# EasyEDA Pro project 科协作业.eprj

# Schematic Schematic1
Board Name: Board1; Create Date: 2024-11-24; Page Name: P1; Project Name: 科协作业; Schematic Name: Schematic1; Update Date: 2024-11-25; Company: 嘉立创EDA; Page Size: A4; Version: V1.0
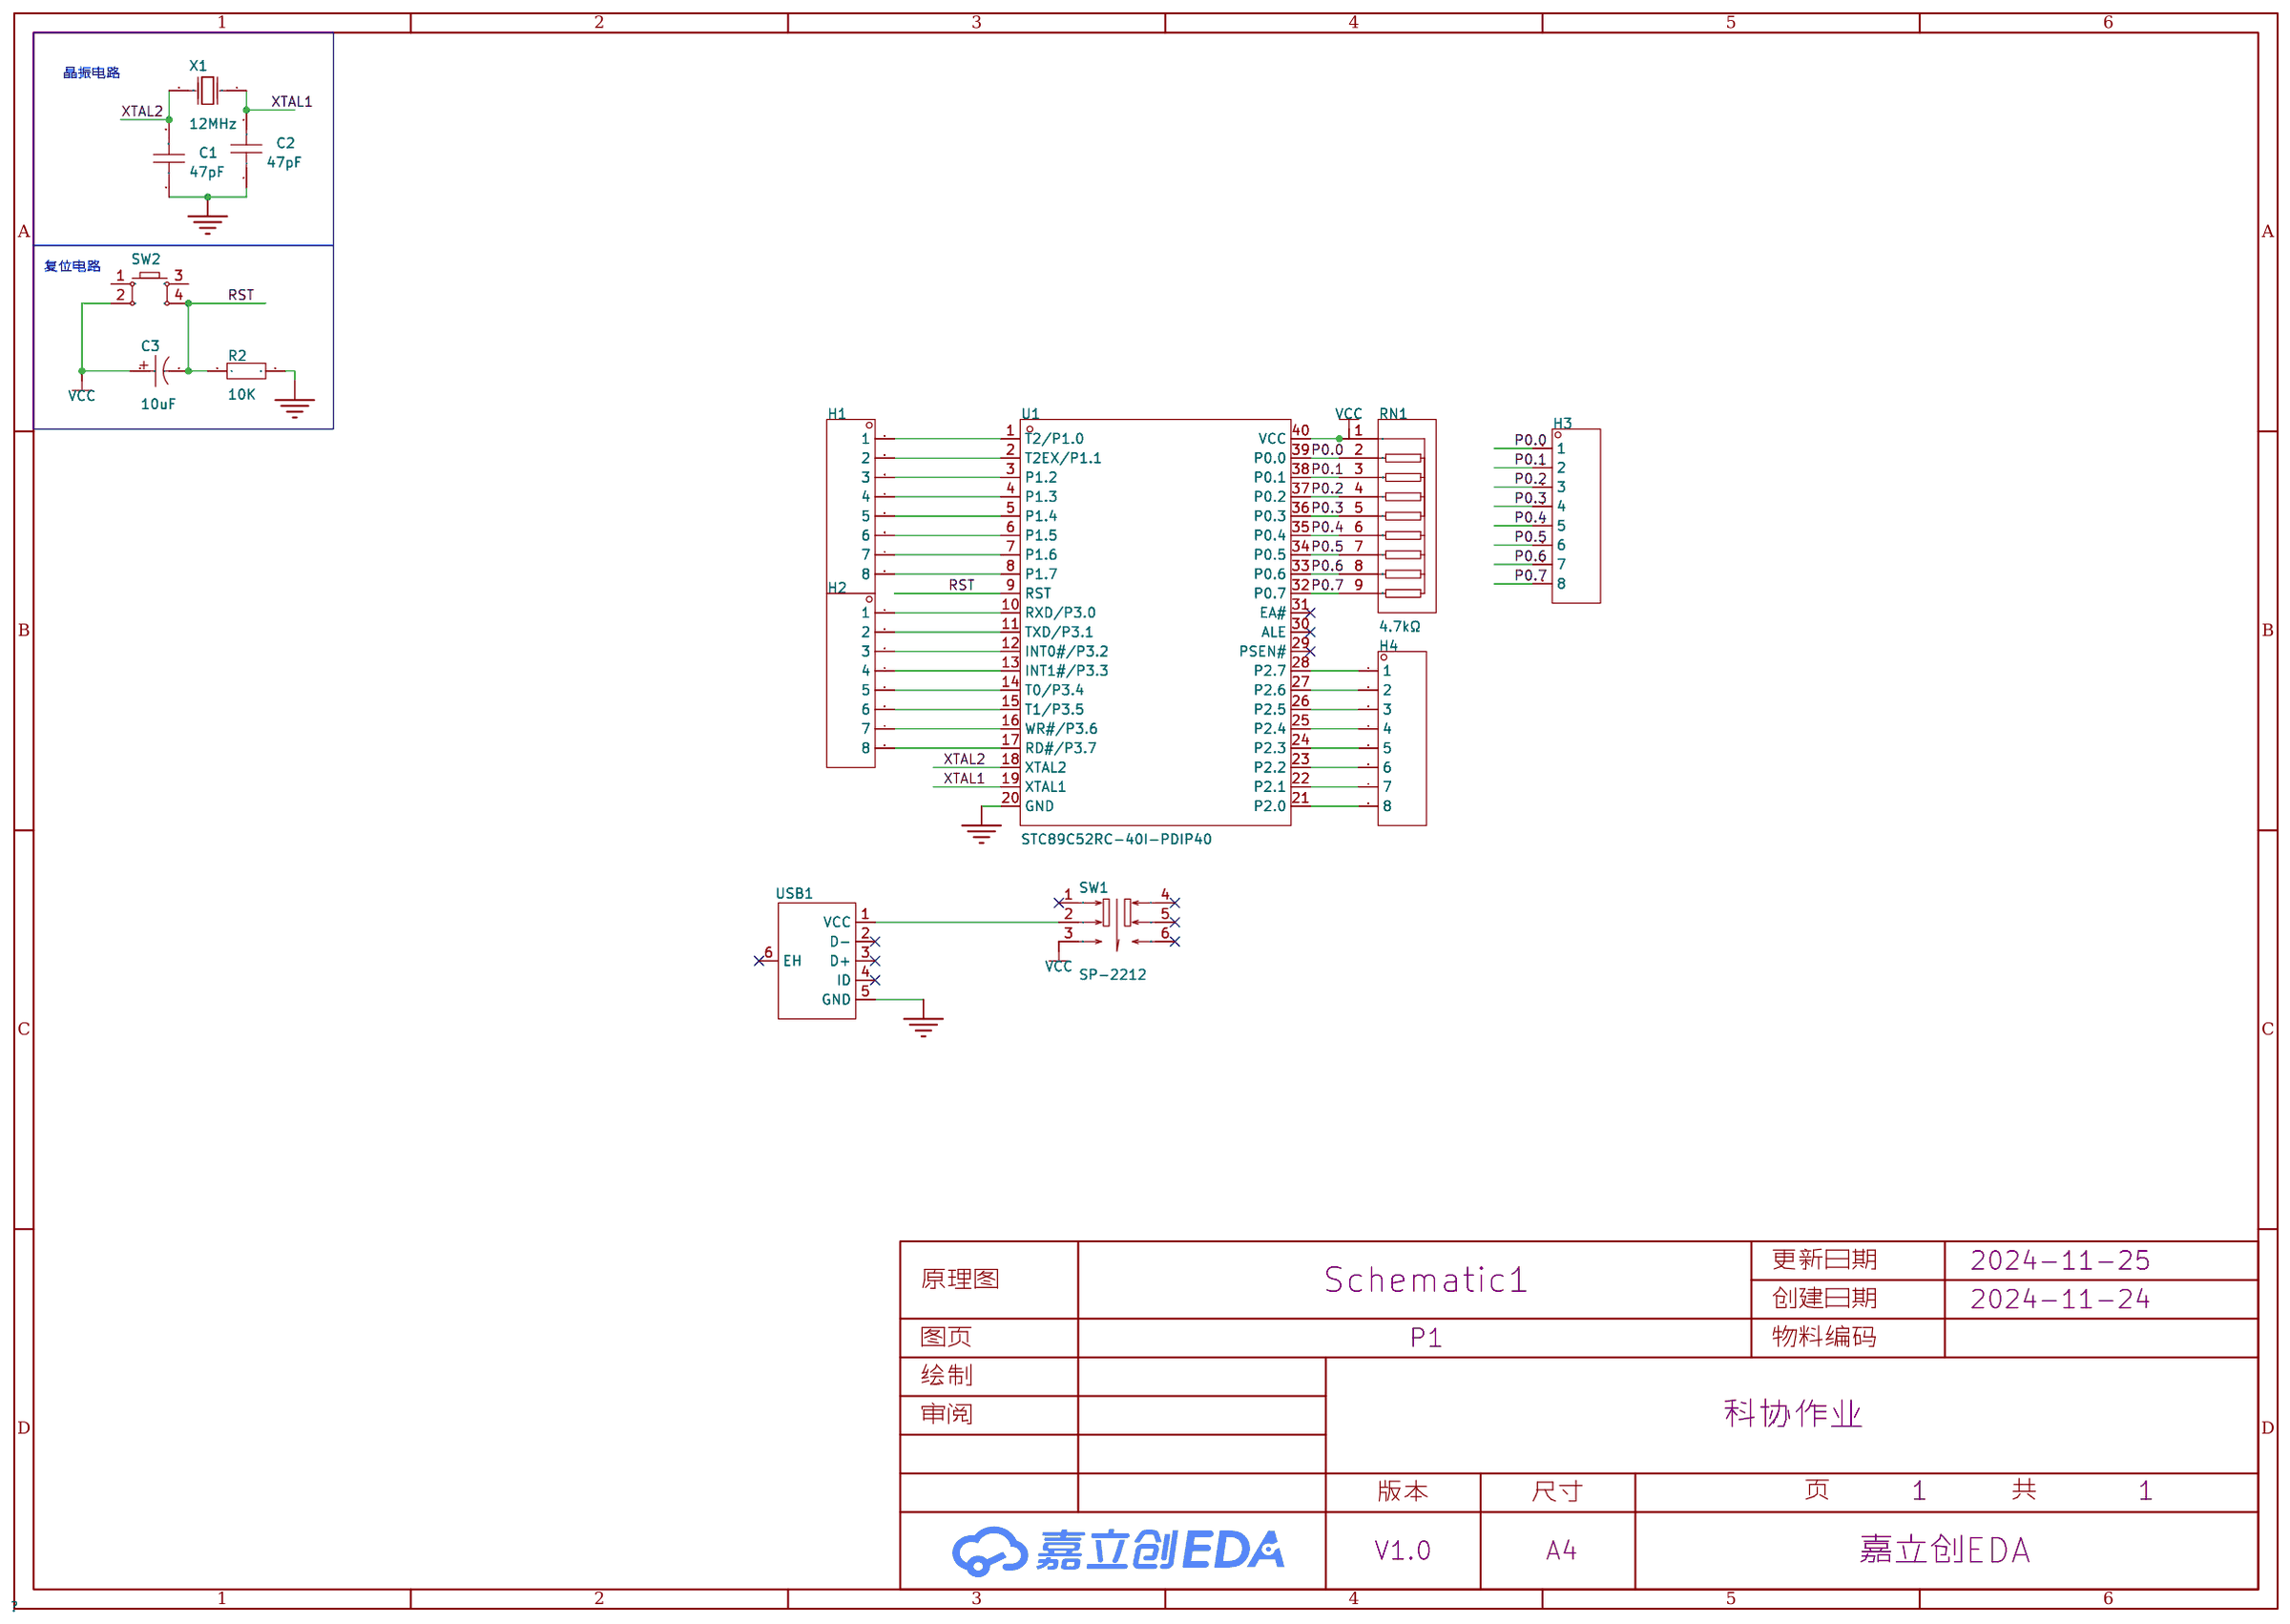
[diagram p0: schematic sheet]

## Parts
C1  47pF  [C0603]
C2  47pF  [C0603]
C3  10uF  [CAP-TH_BD10.0-P5.00-D1.0-FD]
H1  -  [HDR-TH_8P-P2.54-V-M]
H2  -  [HDR-TH_8P-P2.54-V-M]
H3  -  [HDR-TH_8P-P2.54-V-M]
H4  -  [HDR-TH_8P-P2.54-V-M]
R2  10K  [R2010]
RN1  4.7kΩ  [RES-ARRAY-TH_9P-P2.54-D1.0]
SW1  SP-2212  [SW-TH_6P-L7.2-W7.2-P2.00-LS5.0]
SW2  -  [Key_SMD_12x12x7.3]
U1  STC89C52RC-40I-PDIP40  [DIP-40_L52.0-W13.7-P2.54-LS15.2-BL]
USB1  -  [USB_Micro]
X1  12MHz  [HC-49US_L11.5-W4.5-P4.88]

## Library data of the parts
C1 C2 = CAP_0603: Supplier Footprint: 0603
C3 = ERS1HM221G16OT: LCSC Part Name: 220uF ±20% 50V; Supplier Part: C106660; Manufacturer: AISHI(艾华集团); Supplier Footprint: 插件,D10xL16mm; Datasheet: https://atta.szlcsc.com/upload/public/pdf/source/20191015/C438940_4B8E60A742BB0AE40DDEF87A5C89089D.pdf; Supplier: LCSC; Tolerance: ±20%; Rated Voltage: 50V; Lead Spacing: 5mm; φD: 10mm; L: 16mm; Lifetime @ Temp: 7000hrs@105℃
H1-H4 = HDR-M_2.54_1x8P: Supplier Part: C124381; Supplier Footprint: 插件
R2 = Res_2010: Supplier Footprint: 2010
RN1 = A09-472JP: LCSC Part Name: 4.7kΩ ±5%; Supplier Part: C9112; Manufacturer: FH(风华); Supplier Footprint: SIP-9-2.54mm; JLCPCB Part Class: 扩展库; Datasheet: https://atta.szlcsc.com/upload/public/pdf/source/20181127/C336620_2E84FA9E7B5BF76546BC661699514FB8.pdf; Supplier: LCSC; Number of Resistors: 8; Tolerance: ±5%; Power(Watts): 125mW; Temperature Coefficient: ±100ppm/℃; Number of Pins: 9
SW1 = SP-2212: LCSC Part Name: 轻触开关自锁; Supplier Part: C589287; Manufacturer: RISHENG(日昇); Supplier Footprint: 插件; JLCPCB Part Class: 扩展库; Datasheet: https://atta.szlcsc.com/upload/public/pdf/source/20200922/C589287_2DDFEABD4C802D7BFB6520C1CABFFDEF.pdf; Supplier: LCSC; Circuit: 双刀双掷; Self Lock / No Lock: 自锁; Actuator Style: 矩形柱塞; Mounting Style: 直插; Contact Current: 100mA; Voltage Rating (DC): 30V; Insulation Resistance: 100MΩ; Actuator/Cap Color: 蓝色; Pin Style: PC引脚; Operating Force: 230gf; Mechanical Life: 1.2万次
SW2 = Key_SMD_12x12x7.3: Supplier Footprint: SMD
U1 = STC89C52RC-40I-PDIP40: Supplier Part: C14022; Manufacturer: STC(宏晶); Supplier Footprint: DIP-40; JLCPCB Part Class: 扩展库; Datasheet: https://atta.szlcsc.com/upload/public/pdf/source/20210104/C14022_3E6032FDBB5DBC6F971AD019A8472F5B.pdf; Supplier: LCSC; CPU Core: 51系列; Program Storage Size: 8KB; RAM Size: 512Byte; GPIO Ports Number: 35; Operating Voltage Range: 3.3V~5.5V; Program Memory Type: FLASH; Operating Temperature Range: -40℃~+85℃; 16Bit Timer: 3; UART/USART: 1; Peripheral/Function: 看门狗; Watchdog: 有
USB1 = USB_Micro-B: Supplier Footprint: SMD
X1 = X49SD13MSD2SC: LCSC Part Name: 13MHz ±20ppm 20pF; Supplier Part: C30216; Manufacturer: YXC(扬兴晶振); Supplier Footprint: HC-49S; JLCPCB Part Class: 扩展库; Datasheet: https://atta.szlcsc.com/upload/public/pdf/source/20240329/977D7F2434F98B2BE33270BB9FF3D86D.pdf; Supplier: LCSC; Crystal Type: 直插晶振; Normal temperature Frequency Tolerance: ±20ppm; External load capacitor: 20pF; Frequency Stability(Full temperature range): ±30ppm; Operating Temperature: -20℃~+70℃

## Nets
GND: C1.1 C2.1 R2.2 U1.20(GND) USB1.5(GND)
VCC: C3.1 RN1.1 SW1.3 SW2.2 U1.40(VCC)
P0.0: H3.1 RN1.2 U1.39(P0.0)
P0.1: H3.2 RN1.3 U1.38(P0.1)
P0.2: H3.3 RN1.4 U1.37(P0.2)
P0.3: H3.4 RN1.5 U1.36(P0.3)
P0.4: H3.5 RN1.6 U1.35(P0.4)
P0.5: H3.6 RN1.7 U1.34(P0.5)
P0.6: H3.7 RN1.8 U1.33(P0.6)
P0.7: H3.8 RN1.9 U1.32(P0.7)
RST: C3.2 R2.1 SW2.4 U1.9(RST)
XTAL1: C2.2 U1.19(XTAL1) X1.1(OSC1)
XTAL2: C1.2 U1.18(XTAL2) X1.2(OSC2)
$1N1017: H1.1 U1.1(T2/P1.0)
$1N1021: H1.2 U1.2(T2EX/P1.1)
$1N1026: H1.3 U1.3(P1.2)
$1N1031: H1.4 U1.4(P1.3)
$1N1036: H1.5 U1.5(P1.4)
$1N1041: H1.6 U1.6(P1.5)
$1N1046: H1.7 U1.7(P1.6)
$1N1051: H1.8 U1.8(P1.7)
$1N1056: H2.1 U1.10(RXD/P3.0)
$1N1061: H2.2 U1.11(TXD/P3.1)
$1N1066: H2.3 U1.12(INT0#/P3.2)
$1N1074: H2.4 U1.13(INT1#/P3.3)
$1N1079: H2.5 U1.14(T0/P3.4)
$1N1084: H2.6 U1.15(T1/P3.5)
$1N1089: H2.7 U1.16(WR#/P3.6)
$1N1094: H2.8 U1.17(RD#/P3.7)
$1N1233: H4.1 U1.28(P2.7)
$1N1238: H4.2 U1.27(P2.6)
$1N1243: H4.3 U1.26(P2.5)
$1N1251: H4.4 U1.25(P2.4)
$1N1259: H4.5 U1.24(P2.3)
$1N1264: H4.6 U1.23(P2.2)
$1N1272: H4.7 U1.22(P2.1)
$1N1277: H4.8 U1.21(P2.0)
$1N1282: SW1.2 USB1.1(VCC)

Not connected (* = marked no-connect by the designer): SW1 1* 4* 5* 6*; SW2 1 3; U1 29(PSEN#)* 30(ALE)* 31(EA#)*; USB1 2(D-)* 3(D+)* 4(ID)* 6(EH)*

## Notes on the sheet
- 晶振电路
- 复位电路

# Board PCB1
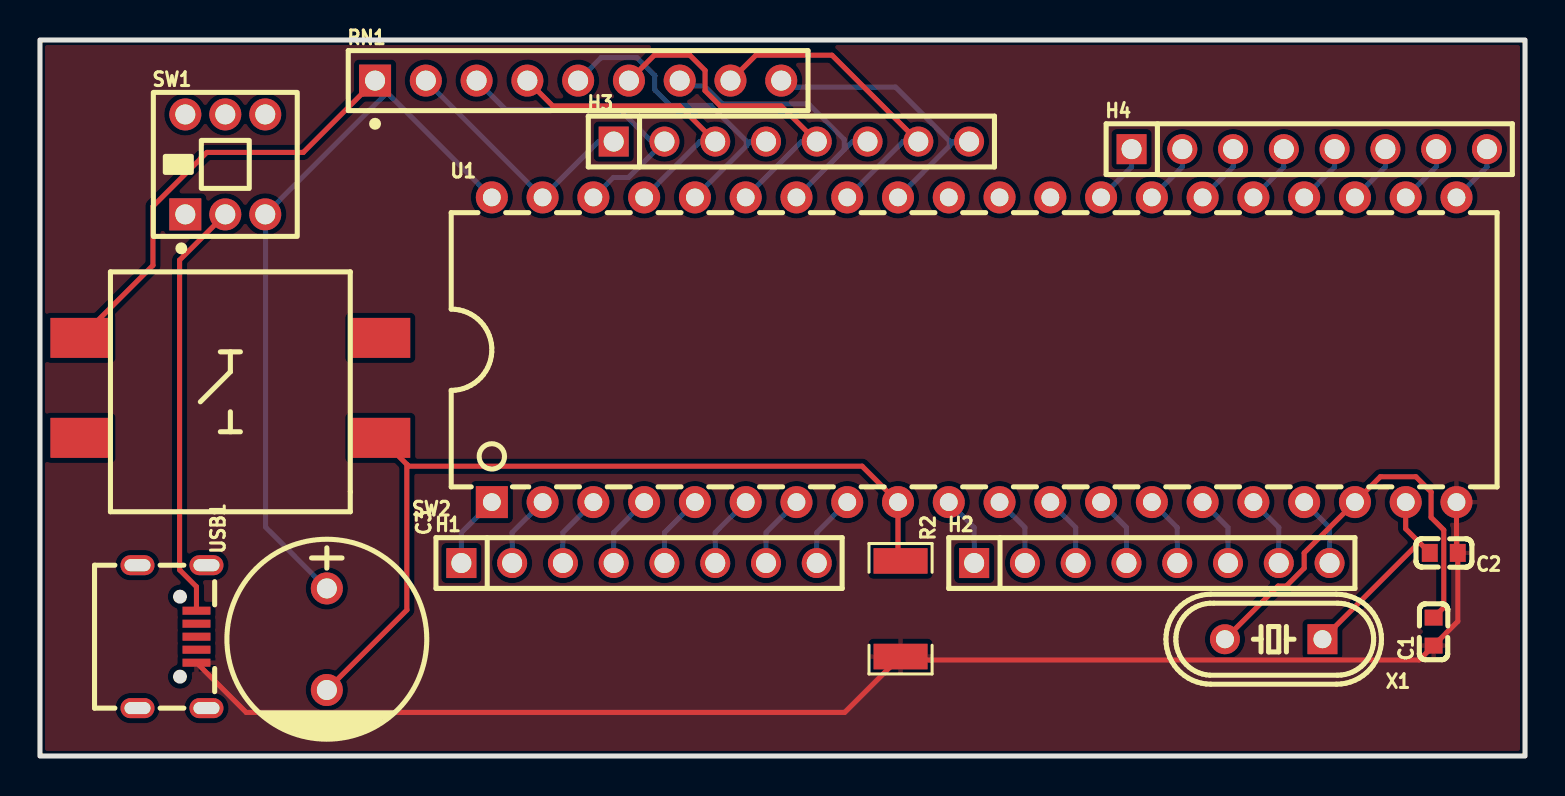
[diagram p1: board, top side]
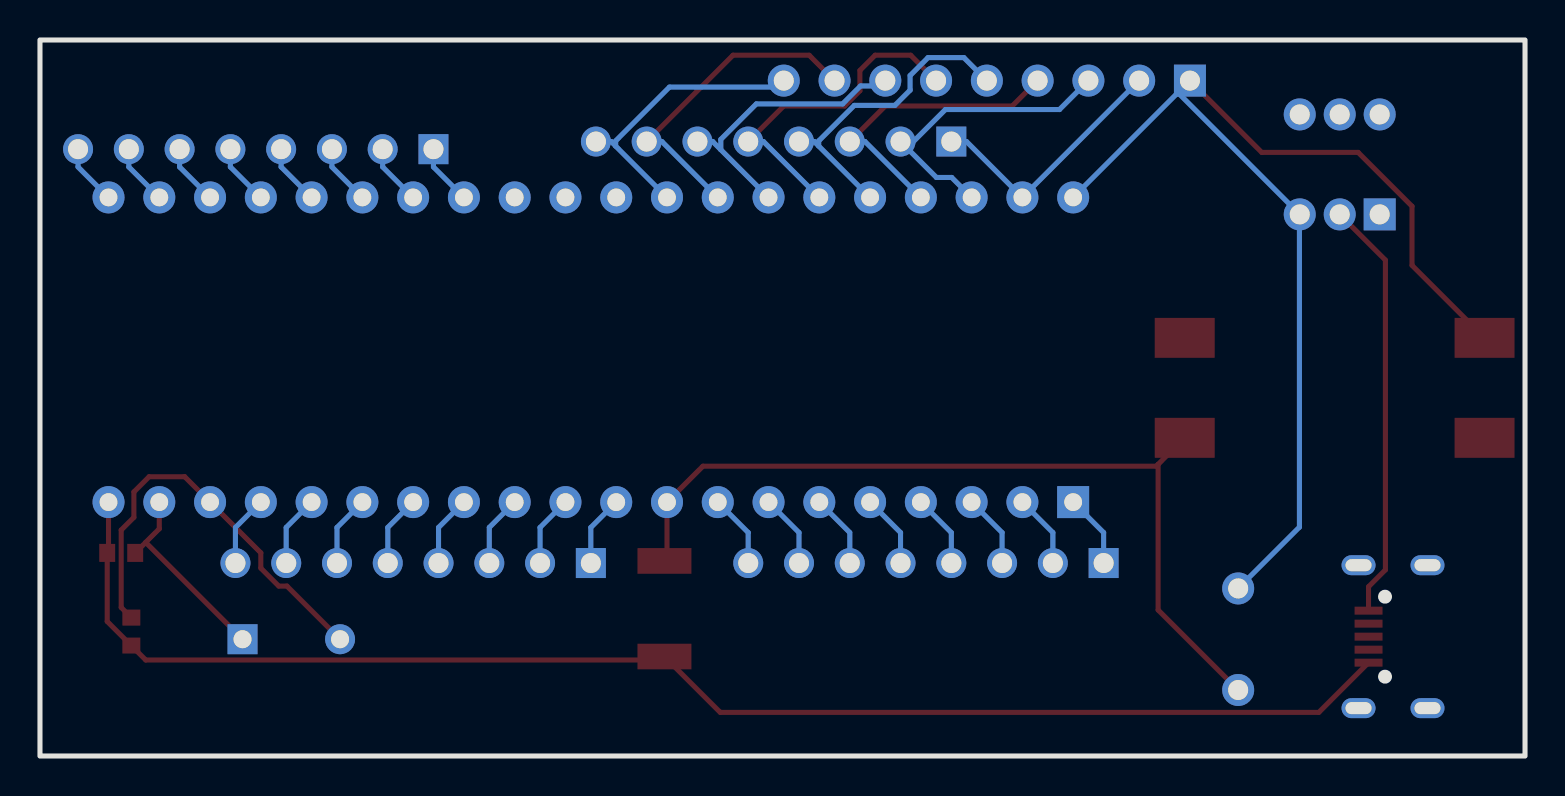
[diagram p2: board, bottom side, seen from below]

Outline 74.3 x 35.81 mm; copper layers: Top Layer, Bottom Layer. Coordinates in mm from the lower left corner of the outline.
Outline path: rectangle 0,35.81 74.3,0
Stack: Top Layer 0.035mm / Dielectric1 1.51mm FR4 er 4.5 / Bottom Layer 0.035mm

## Design rules (mm)
template: JLCPCB Capability(Two Layers Board)
spacing copperThickness1oz (default): track to track 0.102, other pairs 0.152 to 0.3
spacing copperThickness2oz: track to track 0.203, other pairs 0.152 to 0.3
track width copperThickness1oz (default): min 0.127, default 0.254, max 2.54
track width copperThickness2oz: min 0.203, default 0.254, max 2.54
differential pair differentialPair (default): width min 0.127, default 0.254, max 2.54; gap min 0.152, default 0.152
via viaSize (default): diameter min 0.5, default 0.61, max 10; hole min 0.3, default 0.305, max 6.3

## Placement (name value [footprint] x y rotation side)
C1  47pF  [C0603]  69.72 6.22 90 top
C2  47pF  [C0603]  70.23 10.16 180 top
C3  10uF  [CAP-TH_BD10.0-P5.00-D1.0-FD]  14.35 5.84 270 top
H1  -  [HDR-TH_8P-P2.54-V-M]  29.97 9.65 0 top
H2  -  [HDR-TH_8P-P2.54-V-M]  55.63 9.65 0 top
H3  -  [HDR-TH_8P-P2.54-V-M]  37.59 30.73 0 top
H4  -  [HDR-TH_8P-P2.54-V-M]  63.5 30.35 0 top
R2  10K  [R2010]  43.05 7.37 270 top
RN1  4.7kΩ  [RES-ARRAY-TH_9P-P2.54-D1.0]  26.92 33.78 0 top
SW1  SP-2212  [SW-TH_6P-L7.2-W7.2-P2.00-LS5.0]  9.27 29.59 0 top
SW2  -  [Key_SMD_12x12x7.3]  9.52 18.41 180 top
U1  STC89C52RC-40I-PDIP40  [DIP-40_L52.0-W13.7-P2.54-LS15.2-BL]  46.74 20.32 0 top
USB1  -  [USB_Micro]  6.6 5.97 270 top
X1  12MHz  [HC-49US_L11.5-W4.5-P4.88]  61.72 5.84 180 top

## Footprints (pads in the part's own frame, mm; a bottom-side part is the same pattern mirrored in y, then rotated)
C0603
  rect 0.8x0.9 smd: 1(-0.7,0) 2(0.7,0)
CAP-TH_BD10.0-P5.00-D1.0-FD
  round 1.6 hole 1: 1(-2.54,0) 2(2.54,0)
DIP-40_L52.0-W13.7-P2.54-LS15.2-BL
  rect 1.6x1.6 hole 0.889: 1(-24.13,-7.62)
  round 1.6 hole 0.889: 2(-21.59,-7.62) 3(-19.05,-7.62) 4(-16.51,-7.62) 5(-13.97,-7.62) 6(-11.43,-7.62) 7(-8.89,-7.62) 8(-6.35,-7.62) 9(-3.81,-7.62) 10(-1.27,-7.62) 11(1.27,-7.62) 12(3.81,-7.62) 13(6.35,-7.62) 14(8.89,-7.62) 15(11.43,-7.62) 16(13.97,-7.62) 17(16.51,-7.62) 18(19.05,-7.62) 19(21.59,-7.62) 20(24.13,-7.62) 21(24.13,7.62) 22(21.59,7.62) 23(19.05,7.62) 24(16.51,7.62) 25(13.97,7.62) 26(11.43,7.62) 27(8.89,7.62) 28(6.35,7.62) 29(3.81,7.62) 30(1.27,7.62) 31(-1.27,7.62) 32(-3.81,7.62) 33(-6.35,7.62) 34(-8.89,7.62) 35(-11.43,7.62) 36(-13.97,7.62) 37(-16.51,7.62) 38(-19.05,7.62) 39(-21.59,7.62) 40(-24.13,7.62)
HC-49US_L11.5-W4.5-P4.88
  rect 1.5x1.5 hole 0.9: 1(-2.44,0)
  round 1.5 hole 0.9: 2(2.44,0)
HDR-TH_8P-P2.54-V-M
  rect 1.5x1.5 hole 1: 1(-8.89,0)
  round 1.5 hole 1: 2(-6.35,0) 3(-3.81,0) 4(-1.27,0) 5(1.27,0) 6(3.81,0) 7(6.35,0) 8(8.89,0)
Key_SMD_12x12x7.3
  rect 2.999x1.999 smd: 1(-7.5,-2.499) 2(7.5,-2.499) 3(7.5,2.499) 4(-7.5,2.499)
R2010
  rect 1.282x2.7 smd: 1(-2.391,0) 2(2.391,0)
RES-ARRAY-TH_9P-P2.54-D1.0
  rect 1.6x1.6 hole 1: 1(-10.16,0)
  round 1.6 hole 1: 2(-7.62,0) 3(-5.08,0) 4(-2.54,0) 5(0,0) 6(2.54,0) 7(5.08,0) 8(7.62,0) 9(10.16,0)
SW-TH_6P-L7.2-W7.2-P2.00-LS5.0
  rect 1.6x1.6 hole 1: 1(-2,-2.5)
  round 1.6 hole 1: 2(0,-2.5) 3(2,-2.5) 4(-2,2.499) 5(0,2.5) 6(2,2.5)
USB_Micro
  rect 0.4x1.4 smd: 1(-1.3,1.225) 2(-0.65,1.225) 3(0,1.225) 4(0.65,1.225) 5(1.3,1.225)
  oval 1x1.7 hole 0.6x1.3: 6(-3.575,1.725) 6(-3.575,-1.725) 6(3.575,1.725) 6(3.575,-1.725)

## Nets
As in the schematic.

Pads without a net: SW1 1 4 5 6; SW2 1 3; U1 29 30 31; USB1 2 3 4 6

## Routing (per net, layer and track width the routed paths; a pad name or vN(x,y) marks a point on that pad's centre or on a via; arc(x,y) is an arc through that point)
GND: length 72.2
  Top Layer w0.254: U1.20 70.87,10.22 C2.1 70.93,6.73 C1.1 69,4.8 43.23,4.8 R2.2 40.26,2.18 10.32,2.18 USB1.5
VCC: length 58.7
  Top Layer w0.254: RN1.1 13.17,30.19 8.35,30.19 5.65,27.5 5.65,24.54 SW2.2
  Bottom Layer w0.254: 17.35,33.2 17.35,33.17 11.29,27.11 ; 17.35,33.2 RN1.1 ; 17.35,33.2 U1.40 ; 11.29,27.11 SW1.3 ; 11.29,27.11 11.29,11.45 C3.1
P0.0: length 13
  Bottom Layer w0.254: RN1.2 U1.39 27.94,30.73 H3.1
P0.1: length 15.3
  Bottom Layer w0.254: RN1.3 23.29,32.33 29,32.33 30.79,30.54 30.79,30.28 ; 30.79,30.28 29.45,28.94 28.68,28.94 U1.38 ; 30.79,30.28 H3.2
P0.2: length 15.4
  Top Layer w0.254: H3.3 32,32.51 25.65,32.51 RN1.4
  Bottom Layer w0.254: U1.37 33.02,30.73 H3.3
P0.3: length 16
  Bottom Layer w0.254: 35.34,30.51 U1.36 ; 35.34,30.51 35.56,30.73 H3.4 ; 35.34,30.51 35.34,30.76 33.56,32.54 31.53,32.54 30.76,33.3 30.76,34.04 29.87,34.93 28.08,34.93 RN1.5
P0.4: length 17
  Top Layer w0.254: RN1.6 30.73,35.05 32.51,35.05 33.27,34.29 33.27,33.27 34.04,32.51 37.08,32.51 H3.5
  Bottom Layer w0.254: U1.35 38.1,30.73 H3.5
P0.5: length 14.7
  Bottom Layer w0.254: H3.6 40.64,30.73 40.24,30.33 ; 40.24,30.33 U1.34 ; 40.24,30.33 40.24,30.84 38.46,32.62 34.14,32.62 33.24,33.51 32.27,33.51 RN1.7
P0.6: length 16.4
  Top Layer w0.254: H3.7 39.62,35.05 35.81,35.05 RN1.8
  Bottom Layer w0.254: H3.7 43.18,30.73 U1.33
P0.7: length 14.6
  Bottom Layer w0.254: 45.5,30.51 U1.32 ; 45.5,30.51 45.5,30.76 42.8,33.46 37.41,33.46 RN1.9 ; 45.5,30.51 45.72,30.73 H3.8
RST: length 43.2
  Top Layer w0.254: 18.36,14.59 18.36,7.31 C3.2 ; 18.36,14.59 SW2.4 ; 18.36,14.59 18.45,14.5 41.13,14.5 U1.9 42.93,9.88 43.05,9.76
XTAL1: length 9.9
  Top Layer w0.254: 69,10.69 C2.2 ; 69,10.69 69,10.68 X1.1 ; 69,10.69 68.33,11.36 U1.19
XTAL2: length 21.2
  Top Layer w0.254: X1.2 61.94,8.5 62.35,8.5 63.25,9.4 63.25,10.16 U1.18 67.06,13.97 68.83,13.97 69.6,13.21 69.6,11.94 70.23,11.3 70.23,7.43 C1.2
$1N1017: length 3.7
  Bottom Layer w0.254: 21.08,9.65 21.08,11.18 U1.1
$1N1021: length 3.7
  Bottom Layer w0.254: H1.2 23.62,11.18 U1.2
$1N1026: length 3.7
  Bottom Layer w0.254: H1.3 26.16,11.18 U1.3
$1N1031: length 3.7
  Bottom Layer w0.254: H1.4 28.7,11.18 U1.4
$1N1036: length 3.7
  Bottom Layer w0.254: U1.5 31.24,11.18 H1.5
$1N1041: length 3.7
  Bottom Layer w0.254: H1.6 33.78,11.18 U1.6
$1N1046: length 3.7
  Bottom Layer w0.254: U1.7 36.32,11.18 H1.7
$1N1051: length 3.7
  Bottom Layer w0.254: U1.8 38.86,11.18 H1.8
$1N1056: length 3.6
  Bottom Layer w0.254: U1.10 46.74,11.43 H2.1
$1N1061: length 3.6
  Bottom Layer w0.254: U1.11 49.28,11.43 H2.2
$1N1066: length 3.6
  Bottom Layer w0.254: U1.12 51.82,11.43 H2.3
$1N1074: length 3.6
  Bottom Layer w0.254: U1.13 54.36,11.43 H2.4
$1N1079: length 3.6
  Bottom Layer w0.254: H2.5 56.9,11.43 U1.14
$1N1084: length 3.6
  Bottom Layer w0.254: U1.15 59.44,11.43 H2.6
$1N1089: length 3.6
  Bottom Layer w0.254: U1.16 61.98,11.43 H2.7
$1N1094: length 3.6
  Bottom Layer w0.254: H2.8 64.52,11.43 U1.17
$1N1233: length 3
  Bottom Layer w0.254: U1.28 54.61,29.46 H4.1
$1N1238: length 3
  Bottom Layer w0.254: H4.2 57.15,29.46 U1.27
$1N1243: length 3
  Bottom Layer w0.254: H4.3 59.69,29.46 U1.26
$1N1251: length 3
  Bottom Layer w0.254: 62.23,30.35 62.23,29.46 U1.25
$1N1259: length 3
  Bottom Layer w0.254: U1.24 64.77,29.46 H4.5
$1N1264: length 3
  Bottom Layer w0.254: U1.23 67.31,29.46 H4.6
$1N1272: length 3
  Bottom Layer w0.254: 69.85,30.35 69.85,29.46 U1.22
$1N1277: length 3
  Bottom Layer w0.254: U1.21 72.39,29.46 72.39,30.35
$1N1282: length 21.1
  Top Layer w0.254: USB1.1 7.83,8.47 6.98,9.31 6.98,24.8 SW1.2

## Copper pours and planes (outline as drawn; the poured copper is in the pictures)
GND on Top Layer: 0,35.81 74.3,35.81 74.3,0 0,0
GND on Top Layer: 0,35.81 74.3,35.81 74.3,0 0,0
